# Altium schematic sheet UPF_BTB_TESTBOARD.SchDoc
size A4
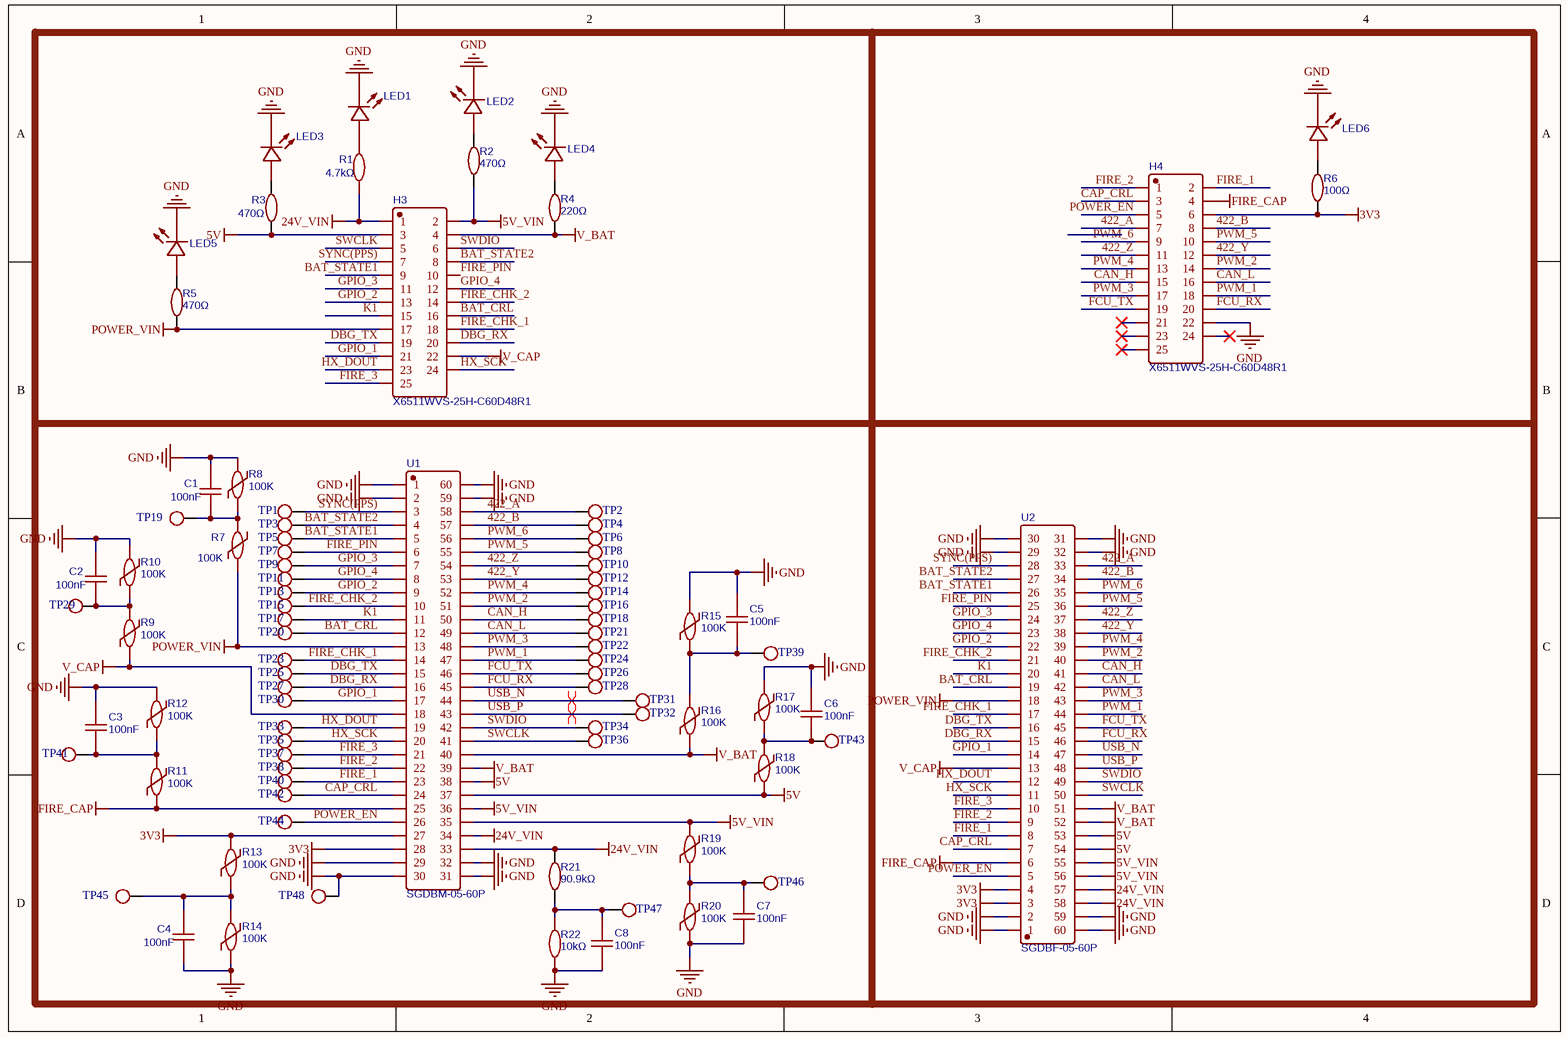
[diagram p0: UPF_BTB_TESTBOARD.SchDoc]

## Parts
C1  100nF  [C0603]
C2  100nF  [C0603]
C3  100nF  [C0603]
C4  100nF  [C0603]
C5  100nF  [C0603]
C6  100nF  [C0603]
C7  100nF  [C0603]
C8  100nF  [C0603]
H3  X6511WVS-25H-C60D48R1  [HDR-SMD_25P-P2.54_XKB_X6511WVS-25H-C60D48R1]
H4  X6511WVS-25H-C60D48R1  [HDR-SMD_25P-P2.54_XKB_X6511WVS-25H-C60D48R1]
LED1  FC-F1005YGK-572J5  [LED0402-RD]  (value not drawn)
LED2  FC-F1005YGK-572J5  [LED0402-RD]  (value not drawn)
LED3  FC-F1005YGK-572J5  [LED0402-RD]  (value not drawn)
LED4  FC-F1005YGK-572J5  [LED0402-RD]  (value not drawn)
LED5  FC-F1005YGK-572J5  [LED0402-RD]  (value not drawn)
LED6  FC-F1005YGK-572J5  [LED0402-RD]  (value not drawn)
R1  4.7kΩ  [R0402]
R2  470Ω  [R0402]
R3  470Ω  [R0402]
R4  220Ω  [R0402]
R5  470Ω  [R0402]
R6  100Ω  [R0402]
R7  100K  [R0603]
R8  100K  [R0603]
R9  100K  [R0603]
R10  100K  [R0603]
R11  100K  [R0603]
R12  100K  [R0603]
R13  100K  [R0603]
R14  100K  [R0603]
R15  100K  [R0603]
R16  100K  [R0603]
R17  100K  [R0603]
R18  100K  [R0603]
R19  100K  [R0603]
R20  100K  [R0603]
R21  90.9kΩ  [R0603]
R22  10kΩ  [R0603]
TP1  TP5  [TP2]  (value not drawn)
TP2  TP5  [TP2]  (value not drawn)
TP3  TP5  [TP2]  (value not drawn)
TP4  TP5  [TP2]  (value not drawn)
TP5  TP5  [TP2]  (value not drawn)
TP6  TP5  [TP2]  (value not drawn)
TP7  TP5  [TP2]  (value not drawn)
TP8  TP5  [TP2]  (value not drawn)
TP9  TP5  [TP2]  (value not drawn)
TP10  TP5  [TP2]  (value not drawn)
TP11  TP5  [TP2]  (value not drawn)
TP12  TP5  [TP2]  (value not drawn)
TP13  TP5  [TP2]  (value not drawn)
TP14  TP5  [TP2]  (value not drawn)
TP15  TP5  [TP2]  (value not drawn)
TP16  TP5  [TP2]  (value not drawn)
TP17  TP5  [TP2]  (value not drawn)
TP18  TP5  [TP2]  (value not drawn)
TP19  TP5  [TP2]  (value not drawn)
TP20  TP5  [TP2]  (value not drawn)
TP21  TP5  [TP2]  (value not drawn)
TP22  TP5  [TP2]  (value not drawn)
TP23  TP5  [TP2]  (value not drawn)
TP24  TP5  [TP2]  (value not drawn)
TP25  TP5  [TP2]  (value not drawn)
TP26  TP5  [TP2]  (value not drawn)
TP27  TP5  [TP2]  (value not drawn)
TP28  TP5  [TP2]  (value not drawn)
TP29  TP5  [TP2]  (value not drawn)
TP30  TP5  [TP2]  (value not drawn)
TP31  TP5  [TP2]  (value not drawn)
TP32  TP5  [TP2]  (value not drawn)
TP33  TP5  [TP2]  (value not drawn)
TP34  TP5  [TP2]  (value not drawn)
TP35  TP5  [TP2]  (value not drawn)
TP36  TP5  [TP2]  (value not drawn)
TP37  TP5  [TP2]  (value not drawn)
TP38  TP5  [TP2]  (value not drawn)
TP39  TP5  [TP2]  (value not drawn)
TP40  TP5  [TP2]  (value not drawn)
TP41  TP5  [TP2]  (value not drawn)
TP42  TP5  [TP2]  (value not drawn)
TP43  TP5  [TP2]  (value not drawn)
TP44  TP5  [TP2]  (value not drawn)
TP45  TP5  [TP2]  (value not drawn)
TP46  TP5  [TP2]  (value not drawn)
TP47  TP5  [TP2]  (value not drawn)
TP48  TP5  [TP2]  (value not drawn)
U1  SGDBM-05-60P  [HG-SGDBM-0.5_60P]
U2  SGDBF-05-60P  [HG-SGDBF-0.5_60P]

## Nets
3V3: H4.6 R6.2 R13.2 U1.27 U1.28 U2.3 U2.4
5V: H3.3 R3.2 R18.1 U1.37 U1.38 U2.53 U2.54
5V_VIN: H3.2 R2.1 R19.2 U1.35 U1.36 U2.55 U2.56
24V_VIN: H3.1 R1.1 R21.2 U1.33 U1.34 U2.57 U2.58
FIRE_CAP: H4.4 R11.1 U1.25 U2.6
GND: C1.1 C2.1 C3.2 C4.2 C5.1 C6.1 C7.2 C8.2 H4.22 LED1.1(K) LED2.1(K) LED3.1(K) LED4.1(K) LED5.1(K) LED6.1(K) R8.2 R10.2 R12.2 R14.1 R15.2 R17.2 R20.1 R22.1 TP48.1 U1.1 U1.2 U1.29 U1.30 U1.31 U1.32 U1.59 U1.60 U2.1 U2.2 U2.29 U2.30 U2.31 U2.32 U2.59 U2.60
POWER_VIN: H3.17 R5.2 R7.1 U1.13 U2.18
V_BAT: H3.4 R4.1 R16.1 U1.39 U1.40 U2.51 U2.52
V_CAP: H3.22 R9.1 U1.18 U2.13
422_A: H4.7 TP2.1 U1.58 U2.33
422_B: H4.8 TP4.1 U1.57 U2.34
422_Y: H4.12 TP12.1 U1.53 U2.38
422_Z: H4.11 TP10.1 U1.54 U2.37
BAT_CRL: H3.16 TP20.1 U1.12 U2.19
BAT_STATE1: H3.9 TP5.1 U1.5 U2.26
BAT_STATE2: H3.8 TP3.1 U1.4 U2.27
CAN_H: H4.15 TP18.1 U1.50 U2.41
CAN_L: H4.16 TP21.1 U1.49 U2.42
CAP_CRL: H4.3 TP42.1 U1.24 U2.7
DBG_RX: H3.20 TP27.1 U1.16 U2.15
DBG_TX: H3.19 TP25.1 U1.15 U2.16
FCU_RX: H4.20 TP28.1 U1.45 U2.46
FCU_TX: H4.19 TP26.1 U1.46 U2.45
FIRE_1: H4.2 TP40.1 U1.23 U2.8
FIRE_2: H4.1 TP38.1 U1.22 U2.9
FIRE_3: H3.25 TP37.1 U1.21 U2.10
FIRE_CHK_1: H3.18 TP23.1 U1.14 U2.17
FIRE_CHK_2: H3.14 TP15.1 U1.10 U2.21
FIRE_PIN: H3.10 TP7.1 U1.6 U2.25
GPIO_1: H3.21 TP30.1 U1.17 U2.14
GPIO_2: H3.13 TP13.1 U1.9 U2.22
GPIO_3: H3.11 TP9.1 U1.7 U2.24
GPIO_4: H3.12 TP11.1 U1.8 U2.23
HX_DOUT: H3.23 TP33.1 U1.19 U2.12
HX_SCK: H3.24 TP35.1 U1.20 U2.11
K1: H3.15 TP17.1 U1.11 U2.20
POWER_EN: H4.5 TP44.1 U1.26 U2.5
PWM_1: H4.18 TP24.1 U1.47 U2.44
PWM_2: H4.14 TP16.1 U1.51 U2.40
PWM_3: H4.17 TP22.1 U1.48 U2.43
PWM_4: H4.13 TP14.1 U1.52 U2.39
PWM_5: H4.10 TP8.1 U1.55 U2.36
PWM_6: H4.9 TP6.1 U1.56 U2.35
SWCLK: H3.5 TP36.1 U1.41 U2.50
SWDIO: H3.6 TP34.1 U1.42 U2.49
SYNC(PPS): H3.7 TP1.1 U1.3 U2.28
USB_N: TP31.1 U1.44 U2.47
USB_P: TP32.1 U1.43 U2.48
NetC1_2: C1.2 R7.2 R8.1 TP19.1
NetC2_2: C2.2 R9.2 R10.1 TP29.1
NetC3_1: C3.1 R11.2 R12.1 TP41.1
NetC4_1: C4.1 R13.1 R14.2 TP45.1
NetC5_2: C5.2 R15.1 R16.2 TP39.1
NetC6_2: C6.2 R17.1 R18.2 TP43.1
NetC7_1: C7.1 R19.1 R20.2 TP46.1
NetC8_1: C8.1 R21.1 R22.2 TP47.1
NetLED1_2: LED1.2(A) R1.2
NetLED2_2: LED2.2(A) R2.2
NetLED3_2: LED3.2(A) R3.1
NetLED4_2: LED4.2(A) R4.2
NetLED5_2: LED5.2(A) R5.1
NetLED6_2: LED6.2(A) R6.1

Not connected (* = marked no-connect by the designer): H4 21* 23* 24* 25*

## Layout directives
differential pair: USB_N, USB_P

## Library data of the parts
C1-C8 = 100nF: BOM_Manufacturer: YAGEO; BOM_Manufacturer Part: CC0603JRX7R8BB104; nameAlias: Capacitance; Contributor: LCSC; BOM_Supplier: LCSC; BOM_Supplier Part: C327087; BOM_JLCPCB Part Class: Extended Part; spicePre: C; spiceSymbolName: CC0603JRX7R8BB104
H3 H4 = X6511WVS-25H-C60D48R1: BOM_Manufacturer: XKB Connectivity(中国星坤); Contributor: LCSC; BOM_Supplier: LCSC; BOM_Supplier Part: C2883821; BOM_Manufacturer Part: X6511WVS-25H-C60D48R1; link: https://atta.szlcsc.com/upload/public/pdf/source/20200909/C780060_F941EB1B69F43B5D6329EAF74E2E27BB.pdf; spicePre: H; spiceSymbolName: X6511WVS-25H-C60D48R1
LED1-LED6 = FC-F1005YGK-572J5: BOM_Manufacturer: NATIONSTAR; Contributor: LCSC; BOM_Supplier: LCSC; BOM_Manufacturer Part: FC-F1005YGK-572J5; BOM_Supplier Part: C130722; BOM_JLCPCB Part Class: Extended Part; spicePre: L; spiceSymbolName: FC-F1005YGK-572J5
R1 = 4.7kΩ: BOM_Manufacturer: Tyohm; BOM_Manufacturer Part: RMC04024.7K1%N; Resistance (Ohms): 4.7K; nameAlias: Resistance; Contributor: LCSC; BOM_Supplier: LCSC; BOM_Supplier Part: C270129; BOM_JLCPCB Part Class: Extended Part; spicePre: R; spiceSymbolName: RMC04024.7K1%N
R2 R3 R5 = 470Ω: BOM_Manufacturer: LIZ; BOM_Manufacturer Part: CR0402FF4700G; nameAlias: Resistance; Resistance (Ohms): 470; BOM_Supplier: LCSC; BOM_Supplier Part: C100443; BOM_JLCPCB Part Class: Extended Part; spicePre: R; spiceSymbolName: CR0402FF4700G
R4 = 220Ω: BOM_Manufacturer: LIZ; BOM_Manufacturer Part: CR0402FF2200G; nameAlias: Resistance; Contributor: LCSC; Resistance (Ohms): 220; BOM_Supplier: LCSC; BOM_Supplier Part: C100308; BOM_JLCPCB Part Class: Extended Part; spicePre: R; spiceSymbolName: CR0402FF2200G
R6 = 100Ω: BOM_Manufacturer: LIZ; BOM_Manufacturer Part: CR0402FF1000G; nameAlias: Resistance; Resistance (Ohms): 100; BOM_Supplier: LCSC; BOM_Supplier Part: C100194; BOM_JLCPCB Part Class: Extended Part; spicePre: R; spiceSymbolName: CR0402FF1000G
R7-R20 = 100K: BOM_Manufacturer: ResistorToday; BOM_Manufacturer Part: TCTR0603F100KF4260T; nameAlias: Value; Contributor: LCSC; BOM_Supplier: LCSC; BOM_Supplier Part: C388278; BOM_JLCPCB Part Class: Extended Part; spicePre: R; spiceSymbolName: TCTR0603F100KF4260T
R21 = 90.9kΩ: BOM_Manufacturer: FH; BOM_Manufacturer Part: RS-03K9092FT; nameAlias: Resistance; Resistance (Ohms): 90.9K; BOM_Supplier: LCSC; BOM_Supplier Part: C140067; BOM_JLCPCB Part Class: Extended Part; spicePre: R; spiceSymbolName: RS-03K9092FT
R22 = 10kΩ: BOM_Manufacturer: Ever Ohms Tech; BOM_Manufacturer Part: TR0603B10KP05250.1W; Resistance (Ohms): 10K; nameAlias: Resistance; Contributor: LCSC; BOM_Supplier: LCSC; BOM_Supplier Part: C188363; BOM_JLCPCB Part Class: Extended Part; spicePre: R; spiceSymbolName: TR0603B10KP05250.1W
TP1-TP48 = TP5: 测试点/单焊盘
U1 U2 = SGDBM-05-60P: BOM_Manufacturer: null; Contributor: LCSC; BOM_Supplier: LCSC; BOM_Supplier Part: C9900010919; BOM_Manufacturer Part: SGDBM-05-60P; BOM_JLCPCB Part Class: Extended Part; spicePre: U; spiceSymbolName: SGDBM-05-60P